# EasyEDA schematic 3 HF Upconverter (SMD)_ Mixer with filters.json
TITLE: HF Upconverter (SMD): Mixer with filters; REV: 8.15.EE; Date: 2018-03-05; Sheet: 3/3; Drawn By: IgrikXD
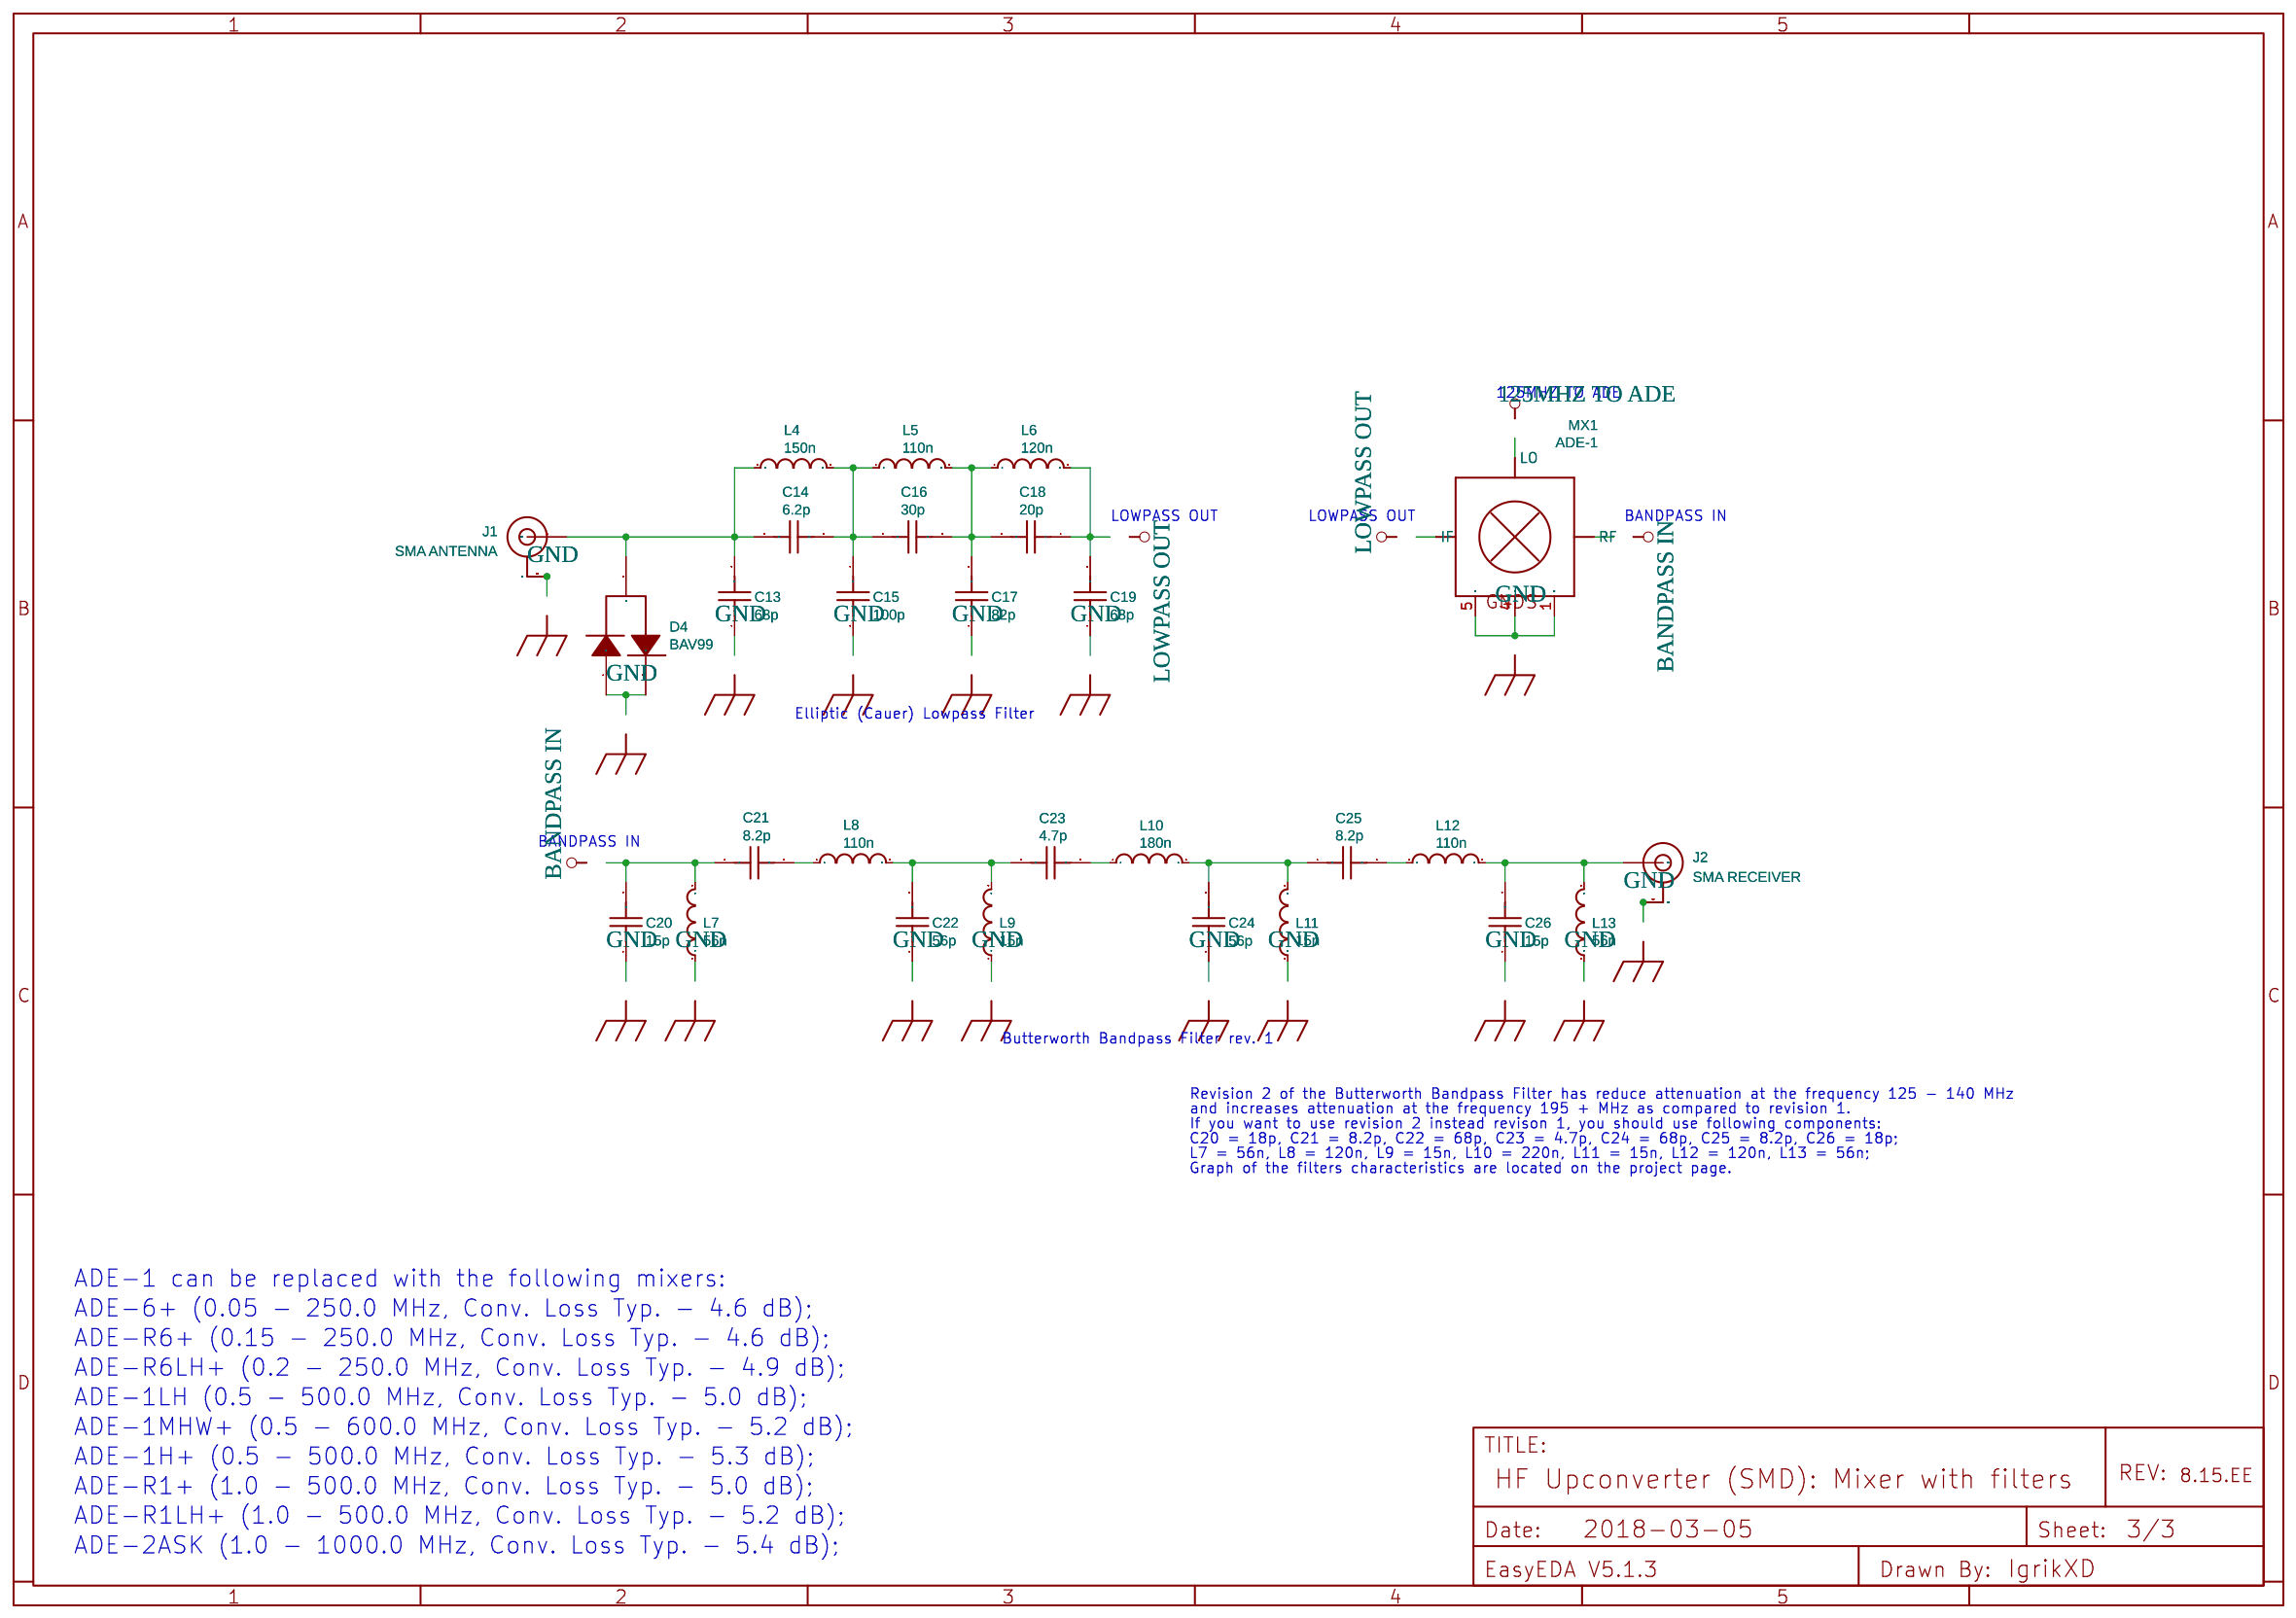
[diagram p0: schematic sheet]

## Parts
C13  68p  [0805]
C14  6.2p  [0805]
C15  100p  [0805]
C16  30p  [0805]
C17  82p  [0805]
C18  20p  [0805]
C19  68p  [0805]
C20  15p  [0805]
C21  8.2p  [0805]
C22  56p  [0805]
C23  4.7p  [0805]
C24  56p  [0805]
C25  8.2p  [0805]
C26  15p  [0805]
D4  BAV99  [SOT-23(SOT-23-3)]
J1  SMA ANTENNA  [SMA-EDGE]
J2  SMA RECEIVER  [SMA-EDGE]
L4  150n  [0805]
L5  110n  [0805]
L6  120n  [0805]
L7  56n  [0805]
L8  110n  [0805]
L9  15n  [0805]
L10  180n  [0805]
L11  15n  [0805]
L12  110n  [0805]
L13  56n  [0805]
MX1  ADE-1  [CD636]

## Library data of the parts
C13 C19 = Capacitor: Supplier: LCSC; LCSC: C123650; Manufacturer: WTC; Manufacturer Part: 0805N680J500
C14 = Capacitor: Manufacturer Part: 0805CG6R2C500NT; Supplier: LCSC; LCSC: C1831; Manufacturer: FH
C15 = Capacitor: Manufacturer Part: C2012C0G2A101JT000N; Supplier: LCSC; LCSC: C76633; Manufacturer: TDK
C16 = Capacitor: Manufacturer Part: CC0805JRNPO9BN300; Supplier: LCSC; LCSC: C107114; Manufacturer: YAGEO
C17 = Capacitor: Manufacturer Part: 0805CG820J500NT; Supplier: LCSC; LCSC: C1841; Manufacturer: FH
C18 = Capacitor: Manufacturer Part: 0805CG200J500NT; Supplier: LCSC; LCSC: C94472; Manufacturer: FH
C20 = Capacitor: Supplier: LCSC; LCSC: C1794; Manufacturer: SAMSUNG; Manufacturer Part: CL21C150JBANNNC
C21 = Capacitor: Supplier: LCSC; LCSC: C1840; Manufacturer: FH; Manufacturer Part: 0805CG8R2C500NT
C22 C24 = Capacitor: Manufacturer Part: 0805CG560J500NT; Supplier: LCSC; LCSC: C1828; Manufacturer: FH
C23 = Capacitor: Manufacturer Part: 0805CG4R7C500NT; Supplier: LCSC; LCSC: C1820; Manufacturer: FH
C25 = Capacitor: Manufacturer Part: 0805CG8R2C500NT; Supplier: LCSC; LCSC: C1840; Manufacturer: FH
C26 = Capacitor: Manufacturer Part: CL21C150JBANNNC; Supplier: LCSC; LCSC: C1794; Manufacturer: SAMSUNG
D4 = -: Supplier: LCSC; Manufacturer: SEMTECH; LCSC: C83868
J1 = -: SMA Antenna Connector; catid: 20; Contributor: Pinoccio; Manufacturer Part: CON-SMA-EDGE-S; Manufacturer: RF Solutions; Supplier: Digi-Key; Digi-Key: CON-SMA-EDGE-S-ND
J2 = -: SMA Antenna Connector; catid: 20; Contributor: Pinoccio; Manufacturer Part: CON-SMA-EDGE-S; Supplier: Digi-Key; Manufacturer: RF Solutions; Digi-Key: CON-SMA-EDGE-S-ND
L4 = Inductor: Manufacturer Part: BKW0805UCR15JGT; Supplier: LCSC; LCSC: C107465; Manufacturer: FH-BK
L5 L8 L12 = Inductor: Manufacturer Part: LQW18ANR11G00D; Supplier: LCSC; LCSC: C113130; Manufacturer: MuRata
L6 = Inductor: Manufacturer Part: BKW0805UCR12JGT; Supplier: LCSC; LCSC: C98546; Manufacturer: FH-BK
L7 = Inductor: Supplier: LCSC; LCSC: C98534; Manufacturer: FH-BK; Manufacturer Part: BKW0805UC056JGT
L9 = Inductor: Supplier: LCSC; LCSC: C107468; Manufacturer Part: BKW0805UC015JGT; Manufacturer: FH-BK
L10 = Inductor: Manufacturer Part: BKW0805UCR18JGT; Supplier: LCSC; LCSC: C107466; Manufacturer: FH-BK
L11 = Inductor: Manufacturer Part: BKW0805UC015JGT; Supplier: LCSC; LCSC: C107468; Manufacturer: FH-BK
L13 = Inductor: Manufacturer Part: BKW0805UC056JGT; Supplier: LCSC; LCSC: C98534; Manufacturer: FH-BK
MX1 = -: catid: 20; Supplier: Mini Circuits; Mini Circuits: ADE-1+; Manufacturer: Mini Circuits; Manufacturer Part: NOT DEFINED

## Nets
GND: C13.1 C15.2 C17.1 C19.1 C20.1 C22.1 C24.1 C26.1 D4.1 D4.2 J1.GND@0(GND) J1.GND@1(GND) J1.GND@2(GND) J1.GND@3(GND) J2.GND@0(GND) J2.GND@1(GND) J2.GND@2(GND) J2.GND@3(GND) L7.1 L9.1 L11.1 L13.1 MX1.1(GND) MX1.4(GND) MX1.5(GND)
125MHZ TO ADE: MX1.6(LO)
BANDPASS IN: C20.2 C21.1 L7.2 MX1.3(RF)
LOWPASS OUT: C18.1 C19.2 L6.2 MX1.2(IF)
Net-(C13-2): C13.2 C14.2 D4.3 J1.SIG(SIGNAL) L4.1
Net-(C14-1): C14.1 C15.1 C16.1 L4.2 L5.1
Net-(C16-2): C16.2 C17.2 C18.2 L5.2 L6.1
Net-(C21-2): C21.2 L8.1
Net-(C22-2): C22.2 C23.1 L8.2 L9.2
Net-(C23-2): C23.2 L10.1
Net-(C24-2): C24.2 C25.1 L10.2 L11.2
Net-(C25-2): C25.2 L12.1
Net-(C26-2): C26.2 J2.SIG(SIGNAL) L12.2 L13.2

## Notes on the sheet
- 125MHZ TO ADE
- LOWPASS OUT
- LOWPASS OUT
- BANDPASS IN
- Elliptic (Cauer) Lowpass Filter
- BANDPASS IN
- Butterworth Bandpass Filter rev. 1
- Revision 2 of the Butterworth Bandpass Filter has reduce attenuation at the frequency 125 - 140 MHz
- If you want to use revision 2 instead revison 1, you should use following components:
- and increases attenuation at the frequency 195 + MHz as compared to revision 1.
- C20 = 18p, C21 = 8.2p, C22 = 68p, C23 = 4.7p, C24 = 68p, C25 = 8.2p, C26 = 18p;
- Graph of the filters characteristics are located on the project page.
- L7 = 56n, L8 = 120n, L9 = 15n, L10 = 220n, L11 = 15n, L12 = 120n, L13 = 56n;
- ADE-1 can be replaced with the following mixers:
- ADE-6+ (0.05 - 250.0 MHz, Conv. Loss Typ. - 4.6 dB);
- ADE-R6+ (0.15 - 250.0 MHz, Conv. Loss Typ. - 4.6 dB);
- ADE-R6LH+ (0.2 - 250.0 MHz, Conv. Loss Typ. - 4.9 dB);
- ADE-1LH (0.5 - 500.0 MHz, Conv. Loss Typ. - 5.0 dB);
- ADE-1MHW+ (0.5 - 600.0 MHz, Conv. Loss Typ. - 5.2 dB);
- ADE-1H+ (0.5 - 500.0 MHz, Conv. Loss Typ. - 5.3 dB);
- ADE-R1+ (1.0 - 500.0 MHz, Conv. Loss Typ. - 5.0 dB);
- ADE-R1LH+ (1.0 - 500.0 MHz, Conv. Loss Typ. - 5.2 dB);
- ADE-2ASK (1.0 - 1000.0 MHz, Conv. Loss Typ. - 5.4 dB);
